# EAGLE schematic MoxonCircuitBoard_v7 (EAGLE 9.7.0)
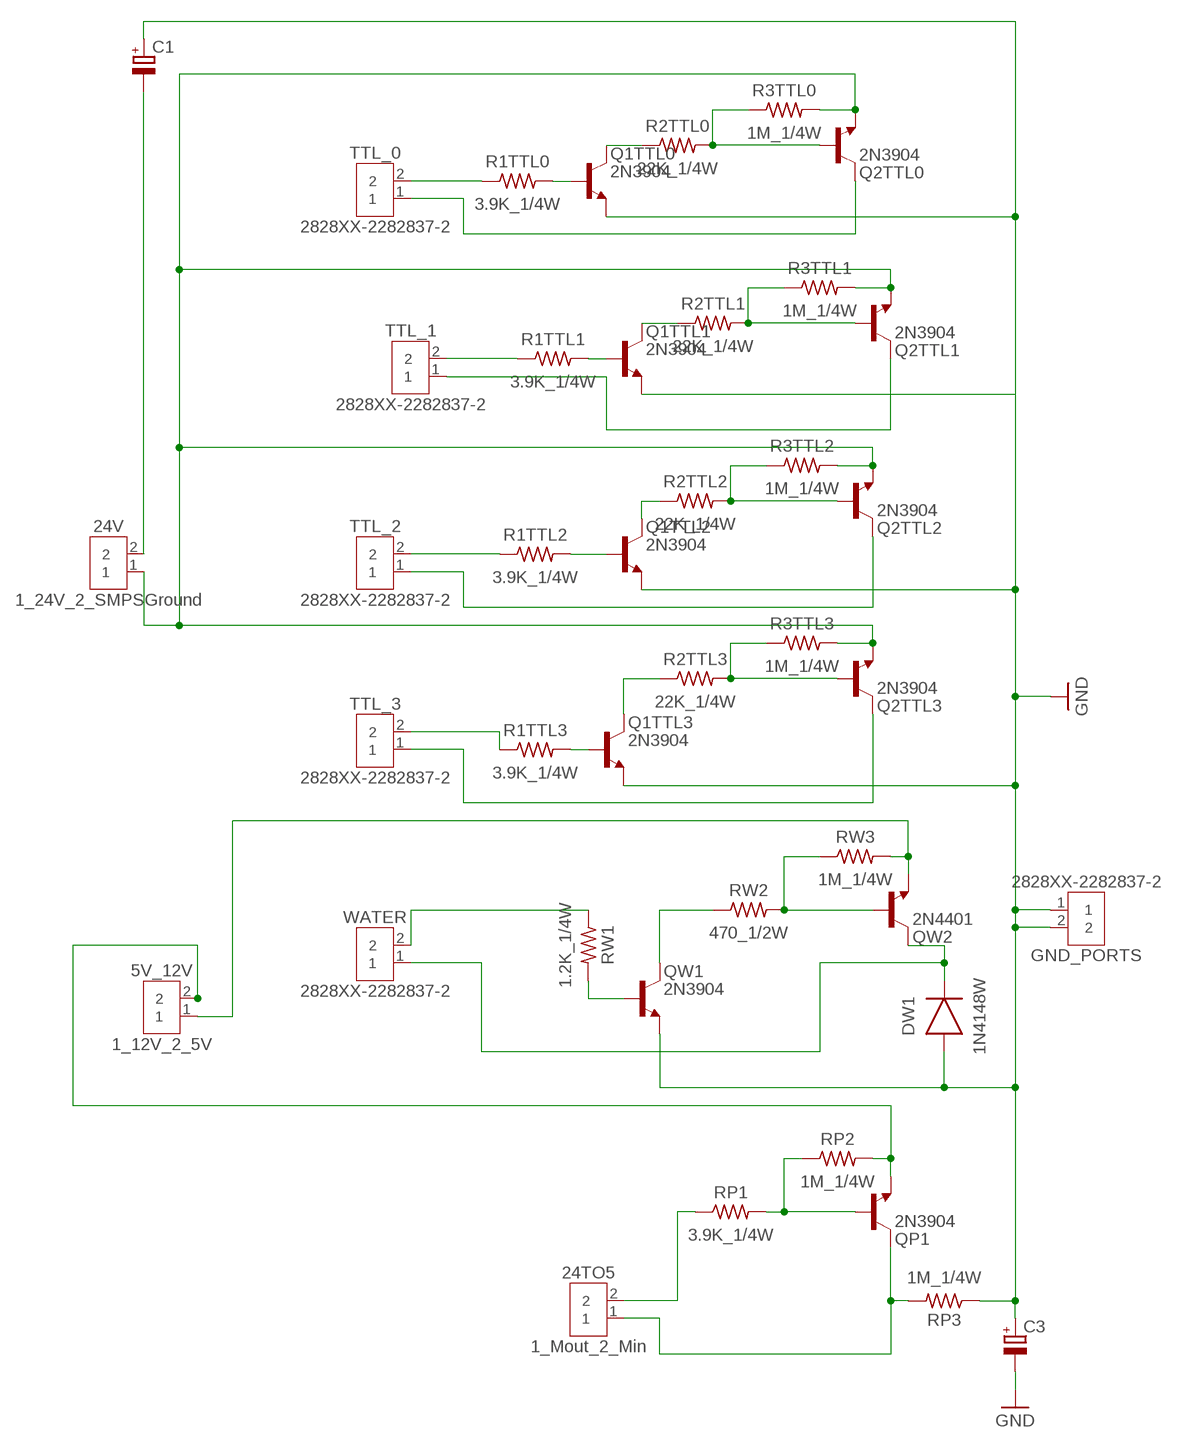
[diagram p0: schematic, sheet 1]

## Parts
5V_12V  1_12V_2_5V  2828XX-2282837-2  [TERMBLK_508-2N]
24TO5  1_Mout_2_Min  2828XX-2282837-2  [TERMBLK_508-2N]
24V  1_24V_2_SMPSGround  2828XX-2282837-2  [TERMBLK_508-2N]
C1  C-POL_RADIAL-20MM-DIA  [CAPPRD550W60D1200H2000B]
C3  C-POL_RADIAL-20MM-DIA  [CAPPRD550W60D1200H2000B]
DW1  1N4148W  DIODE_1N4148W-7-F_SOD123G  [SOD3715X135]
GND_PORTS  2828XX-2282837-2  [TERMBLK_508-2N]
Q1TTL0  2N3904  NPN_2N3904_TO92  [TO92]
Q1TTL1  2N3904  NPN_2N3904_TO92  [TO92]
Q1TTL2  2N3904  NPN_2N3904_TO92  [TO92]
Q1TTL3  2N3904  NPN_2N3904_TO92  [TO92]
Q2TTL0  2N3904  NPN_2N3904_TO92  [TO92]
Q2TTL1  2N3904  NPN_2N3904_TO92  [TO92]
Q2TTL2  2N3904  NPN_2N3904_TO92  [TO92]
Q2TTL3  2N3904  NPN_2N3904_TO92  [TO92]
QP1  2N3904  NPN_2N3904_TO92  [TO92]
QW1  2N3904  NPN_2N3904_TO92  [TO92]
QW2  2N4401  NPN_2N4401_TO92  [TO92]
R1TTL0  3.9K_1/4W  R-US_AXIAL-11.7MM-PITCH  [RESAD1176W63L850D250B]
R1TTL1  3.9K_1/4W  R-US_AXIAL-11.7MM-PITCH  [RESAD1176W63L850D250B]
R1TTL2  3.9K_1/4W  R-US_AXIAL-11.7MM-PITCH  [RESAD1176W63L850D250B]
R1TTL3  3.9K_1/4W  R-US_AXIAL-11.7MM-PITCH  [RESAD1176W63L850D250B]
R2TTL0  22K_1/4W  R-US_AXIAL-11.7MM-PITCH  [RESAD1176W63L850D250B]
R2TTL1  22K_1/4W  R-US_AXIAL-11.7MM-PITCH  [RESAD1176W63L850D250B]
R2TTL2  22K_1/4W  R-US_AXIAL-11.7MM-PITCH  [RESAD1176W63L850D250B]
R2TTL3  22K_1/4W  R-US_AXIAL-11.7MM-PITCH  [RESAD1176W63L850D250B]
R3TTL0  1M_1/4W  R-US_AXIAL-11.7MM-PITCH  [RESAD1176W63L850D250B]
R3TTL1  1M_1/4W  R-US_AXIAL-11.7MM-PITCH  [RESAD1176W63L850D250B]
R3TTL2  1M_1/4W  R-US_AXIAL-11.7MM-PITCH  [RESAD1176W63L850D250B]
R3TTL3  1M_1/4W  R-US_AXIAL-11.7MM-PITCH  [RESAD1176W63L850D250B]
RP1  3.9K_1/4W  R-US_AXIAL-11.7MM-PITCH  [RESAD1176W63L850D250B]
RP2  1M_1/4W  R-US_AXIAL-11.7MM-PITCH  [RESAD1176W63L850D250B]
RP3  1M_1/4W  R-US_AXIAL-11.7MM-PITCH  [RESAD1176W63L850D250B]
RW1  1.2K_1/4W  R-US_AXIAL-11.7MM-PITCH  [RESAD1176W63L850D250B]
RW2  470_1/2W  R-US_AXIAL-11.7MM-PITCH  [RESAD1176W63L850D250B]
RW3  1M_1/4W  R-US_AXIAL-11.7MM-PITCH  [RESAD1176W63L850D250B]
TTL_0  2828XX-2282837-2  [TERMBLK_508-2N]
TTL_1  2828XX-2282837-2  [TERMBLK_508-2N]
TTL_2  2828XX-2282837-2  [TERMBLK_508-2N]
TTL_3  2828XX-2282837-2  [TERMBLK_508-2N]
WATER  2828XX-2282837-2  [TERMBLK_508-2N]

## Nets
GND: C1.1(+) C3.1(+) C3.2(-) DW1.2(A) GND_PORTS.1 GND_PORTS.2 Q1TTL0.1(E) Q1TTL1.1(E) Q1TTL2.1(E) Q1TTL3.1(E) QW1.1(E) RP3.1
N$1: QP1.2(B) RP1.2 RP2.1
N$2: 24V.2 C1.2(-)
N$3: 24TO5.1 QP1.3(C) RP3.2
N$4: 24TO5.2 RP1.1
N$5: QW1.2(B) RW1.2
N$6: QW1.3(C) RW2.1
N$7: QW2.2(B) RW2.2 RW3.1
N$8: 5V_12V.1 QW2.1(E) RW3.2
N$9: DW1.1(C) QW2.3(C) WATER.1
N$10: Q1TTL3.2(B) R1TTL3.2
N$11: Q1TTL3.3(C) R2TTL3.1
N$12: Q2TTL3.2(B) R2TTL3.2 R3TTL3.1
N$13: Q2TTL3.3(C) TTL_3.1
N$14: Q1TTL2.2(B) R1TTL2.2
N$15: Q1TTL2.3(C) R2TTL2.1
N$16: Q2TTL2.2(B) R2TTL2.2 R3TTL2.1
N$17: R1TTL3.1 TTL_3.2
N$18: Q1TTL1.2(B) R1TTL1.2
N$19: Q1TTL1.3(C) R2TTL1.1
N$20: Q2TTL1.2(B) R2TTL1.2 R3TTL1.1
N$21: R1TTL2.1 TTL_2.2
N$22: Q1TTL0.2(B) R1TTL0.2
N$23: Q1TTL0.3(C) R2TTL0.1
N$24: Q2TTL0.2(B) R2TTL0.2 R3TTL0.1
N$25: 24V.1 Q2TTL0.1(E) Q2TTL1.1(E) Q2TTL2.1(E) Q2TTL3.1(E) R3TTL0.2 R3TTL1.2 R3TTL2.2 R3TTL3.2
N$26: Q2TTL2.3(C) TTL_2.1
N$27: R1TTL0.1 TTL_0.2
N$28: Q2TTL0.3(C) TTL_0.1
N$29: R1TTL1.1 TTL_1.2
N$32: Q2TTL1.3(C) TTL_1.1
N$33: RW1.1 WATER.2
N$34: 5V_12V.2 QP1.1(E) RP2.2

## Library data of the parts
5V_12V 24TO5 24V GND_PORTS TTL_0 TTL_1-TTL_3 WATER = Connector:2828XX-2: 2 Position Wire to Board Terminal Block Horizontal with Board Datasheet <https://www.te.com.cn/commerce/DocumentDelivery/DDEController?Action=showdoc&DocId=Catalog+Section%7F1308389_EUROSTYLE_TERMINAL_BLOCKS%7F0607%7Fpdf%7FEnglish%7FENG_CS_1308389_EUROSTYLE_TERMINAL_BLOCKS_0607.pdf%7F2-282837-5>; CATEGORY: Connector; DESCRIPTION: 2 Position Wire to Board Terminal Block Horizontal with Board 5.08 mm Through Hole; MANUFACTURER: TE Connectivity; MPN: 282837-2; OPERATING_TEMPERATURE: -40°C to +105°C; PART_STATUS: ACTIVE; ROHS_COMPLIANCE: RoHS Compliant; SERIES: 282837; SUBCATEGORY: Terminal Block; TYPE: Side Wire Entry
C1 C3 = Capacitor:C-POL: Capacitor Polarised - Generic; CATEGORY: Capacitor
DW1 = Diode:DIODE_: Diode Rectifier - Popular parts; CATEGORY: Diode; DESCRIPTION: DIODE GEN PURP 100V 300MA SOD123; MANUFACTURER: Diodes Incorporated; SUB-CATEGORY: Rectifier
Q1TTL0 Q1TTL1-Q1TTL3 Q2TTL0 Q2TTL1-Q2TTL3 QP1 QW1 QW2 = Transistor:NPN_: NPN - Popular parts; CATEGORY: Transistor; SUB-CATEGORY: BJT; TYPE: NPN
R1TTL0 R1TTL1-R1TTL3 R2TTL0 R2TTL1-R2TTL3 R3TTL0 R3TTL1-R3TTL3 RP1-RP3 RW1-RW3 = Resistor:R-US: Resistor Fixed - ANSI; CATEGORY: Resistor; SUB-CATEGORY: Fixed